# Altium schematic sheet TX_PA_Stage2.SchDoc
size B; SheetNumber: 8; SheetTotal: 12
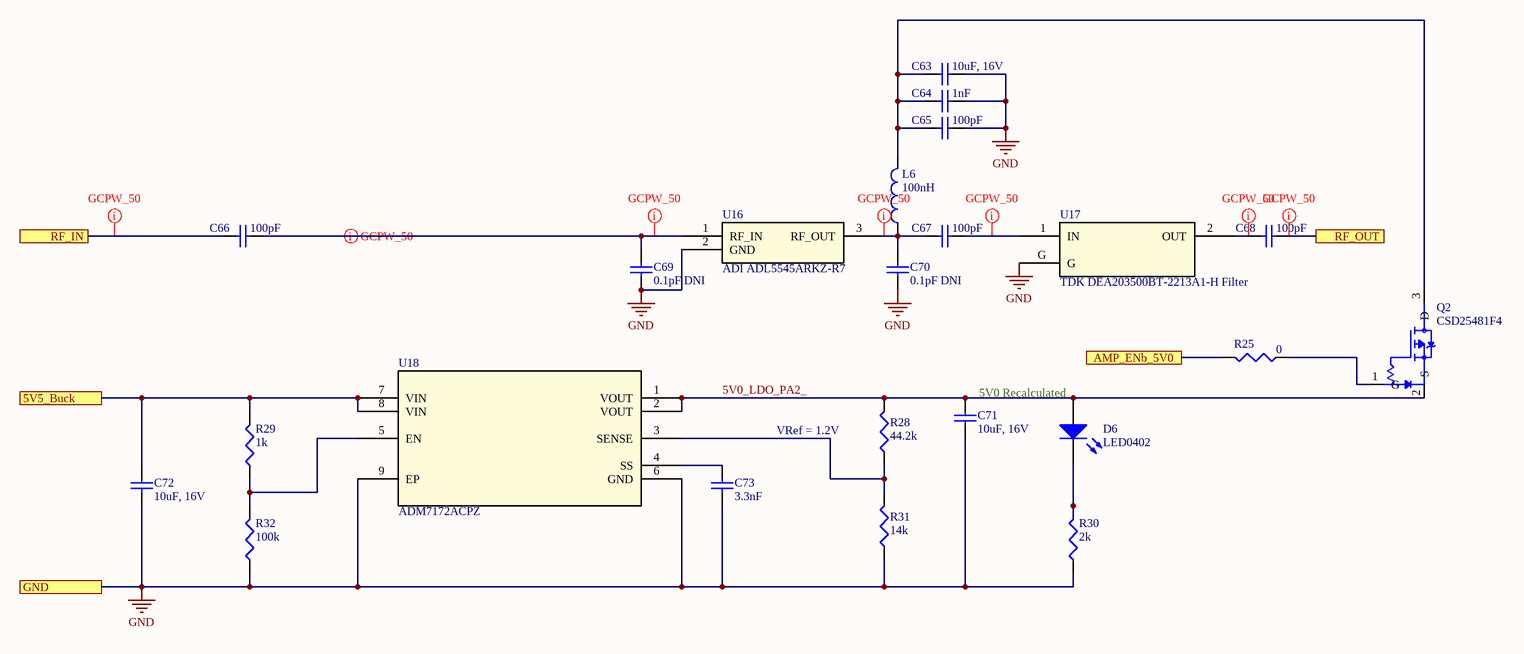
[diagram p0: TX_PA_Stage2.SchDoc]

## Parts
C63  10uF, 16V  [SMD-0603]
C64  1nF  [SMD-0402]
C65  100pF  [SMD-0402]
C66  100pF  [SMD-0402]
C67  100pF  [SMD-0402]
C68  100pF  [SMD-0402]
C69  0.1pF DNI  [SMD-0402]
C70  0.1pF DNI  [SMD-0402]
C71  10uF, 16V  [SMD-0603]
C72  10uF, 16V  [SMD-0603]
C73  3.3nF  [Johanson-0201]
D6  LED0402  [LED-0402]
L6  100nH  [SMD-0402]
Q2  CSD25481F4  [CSD25481F4]
R25  0  [SMD-0402]
R28  44.2k  [SMD-0402]
R29  1k  [SMD-0402]
R30  2k  [SMD-0402]
R31  14k  [SMD-0402]
R32  100k  [SMD-0402]
U16  ADI ADL5545ARKZ-R7  [Analog Devices ADL5545ARKZ]
U17  TDK DEA203500BT-2213A1-H Filter  [TDK DEA203500BT-2213A1-H Bandpass Filter]
U18  ADM7172ACPZ  [ADM7172_VIA_NOSILK]

## Ports
5V5_Buck, AMP_ENb_5V0, GND, RF_IN, RF_OUT

## Nets
GND: C63.1 C64.2 C65.2 C69.1 C70.1 C71.1 C72.1 C73.1 R30.1 R31.1 R32.1 U16.2(GND) U17.G U18.6(GND) U18.9(EP) ; port GND
5V0_LDO_PA2_: C71.2 D6.2(A) Q2.2(S) R28.2 U18.1(VOUT) U18.2(VOUT)
5V5_Buck: C72.2 R29.2 U18.7(VIN) U18.8(VIN) ; port 5V5_Buck
AMP_ENb_5V0: R25.2 ; port AMP_ENb_5V0
RF_IN: C66.1 ; port RF_IN
RF_OUT: C68.2 ; port RF_OUT
NetC63_2: C63.2 C64.1 C65.1 L6.2 Q2.3(D)
NetC66_2: C66.2 C69.2 U16.1(RF_IN)
NetC67_1: C67.1 C70.2 L6.1 U16.3(RF_OUT)
NetC67_2: C67.2 U17.1(IN)
NetC68_1: C68.1 U17.2(OUT)
NetC73_2: C73.2 U18.4(SS)
NetD6_1: D6.1(K) R30.2
NetQ2_1: Q2.1(G) R25.1
NetR28_1: R28.1 R31.2 U18.3(SENSE)
NetR29_1: R29.1 R32.2 U18.5(EN)

## Layout directives
net class GCPW_50: NetC66_2, NetC67_1, NetC67_2, NetC68_1, RF_IN, RF_OUT

## Notes on the sheet
- 5V0 Recalculated
- (near R28) VRef = 1.2V

## Library data of the parts
C63 C71 C72 = CAP0603: Ceramic Capacitor 0603
C64-C70 = CAP0402: Ceramic Capacitor 0402
C73 = CAP0201: Capacitor 0201 Imperial
D6 = LED0402: LED 0402
L6 = L0402: Inductor 0402
Q2 = CSD25481F4: -20V, P ch NexFET MOSFET, single LGA 0.6x1.0, 105mOhm 3-PICOSTAR -55 to 150; MF: Texas Instruments; MP: CSD25481F4; Purchase-URL: https://pricing.snapeda.com/search/part/CSD25481F4/?ref=eda; Price: None; SnapEDA_Link: https://www.snapeda.com/parts/CSD25481F4/Texas%20Instruments/view-part/808987/?ref=snap; Check_prices: https://www.snapeda.com/parts/CSD25481F4/Texas%20Instruments/view-part/808987/?ref=eda; Package: PICOSTAR-3 Texas Instruments; Availability: Good; Value: *
R25 R28-R32 = RES0402: Resistor-0402
U16 = ADI ADL5545ARKZ-R7: No Description Available; Mfr_Name: Analog Devices Inc; RefDes: RefDes; Type: Type
U17 = TDK DEA203500BT-2213A1-H Filter: 3.5 GHz Center Freq BPF; Mfr_Name: TDK; RefDes: RefDes; Type: Type
U18 = ADM7172ACPZ: 6.5V, 2A, Ultralow Noise, High PSRR, Fast Transient Response CMOS LDO; Value: Value; Type: Type; RefDes: RefDes